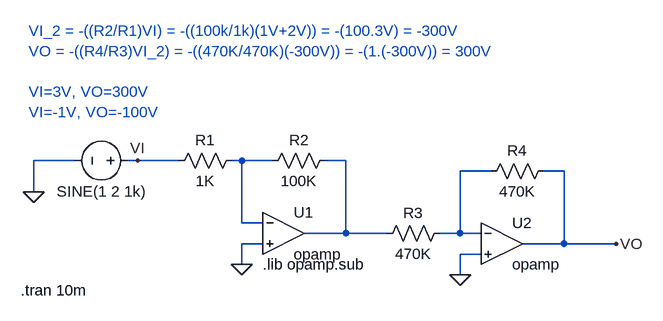
[diagram p0: schematic AMP18 - Amplificadores em Cascata.asc]
AMP18 - Amplificadores em Cascata.asc, the LTspice schematic file:
Version 4
SHEET 1 880 680
WIRE -336 32 -400 32
WIRE -240 32 -256 32
WIRE -176 32 -240 32
WIRE -80 32 -96 32
WIRE -32 32 -80 32
WIRE 80 32 48 32
WIRE 304 48 256 48
WIRE 416 48 384 48
WIRE -400 80 -400 32
WIRE -80 128 -80 32
WIRE -48 128 -80 128
WIRE 80 144 80 32
WIRE 80 144 16 144
WIRE 144 144 80 144
WIRE 256 144 256 48
WIRE 256 144 224 144
WIRE 288 144 256 144
WIRE -48 160 -80 160
WIRE 416 160 416 48
WIRE 416 160 352 160
WIRE 496 160 416 160
WIRE 288 176 256 176
WIRE -80 192 -80 160
WIRE 256 208 256 176
FLAG -240 32 VI
FLAG 496 160 VO
FLAG -80 192 0
FLAG 256 208 0
FLAG -400 80 0
SYMBOL Opamps\\opamp -16 80 R0
SYMATTR InstName U1
SYMBOL Opamps\\opamp 320 96 R0
SYMATTR InstName U2
SYMBOL res 240 128 R90
WINDOW 0 0 56 VBottom 2
WINDOW 3 32 56 VTop 2
SYMATTR InstName R3
SYMATTR Value 470K
SYMBOL res 400 32 R90
WINDOW 0 0 56 VBottom 2
WINDOW 3 32 56 VTop 2
SYMATTR InstName R4
SYMATTR Value 470K
SYMBOL res 64 16 R90
WINDOW 0 0 56 VBottom 2
WINDOW 3 32 56 VTop 2
SYMATTR InstName R2
SYMATTR Value 100K
SYMBOL res -80 16 R90
WINDOW 0 0 56 VBottom 2
WINDOW 3 32 56 VTop 2
SYMATTR InstName R1
SYMATTR Value 1K
SYMBOL voltage -240 32 R90
WINDOW 0 -32 56 Invisible 2
WINDOW 3 32 56 VTop 2
WINDOW 123 0 0 Left 2
WINDOW 39 0 0 Left 2
SYMATTR InstName V1
SYMATTR Value SINE(1 2 1k)
TEXT -48 192 Left 2 !.lib opamp.sub
TEXT -408 -168 Left 2 ;VI_2 = -((R2/R1)VI) = -((100k/1k)(1V+2V)) = -(100.3V) = -300V\nVO = -((R4/R3)VI_2) = -((470K/470K)(-300V)) = -(1.(-300V)) = 300V \n \nVI=3V, VO=300V\nVI=-1V, VO=-100V
TEXT -420 232 Left 2 !.tran 10m

The netlist it stands for:
* AMP18 - Amplificadores em Cascata.asc
XU1 N001 0 N002 opamp Aol=100K GBW=10Meg  ; pins invin noninvin out
XU2 N003 0 VO opamp Aol=100K GBW=10Meg  ; pins invin noninvin out
R3 N003 N002 470K
R4 VO N003 470K
R2 N002 N001 100K
R1 N001 VI 1K
V1 VI 0 SINE(1 2 1k)
.lib opamp.sub
* VI_2 = -((R2/R1)VI) = -((100k/1k)(1V+2V)) = -(100.3V) = -300V
* VO = -((R4/R3)VI_2) = -((470K/470K)(-300V)) = -(1.(-300V)) = 300V
* VI=3V, VO=300V
* VI=-1V, VO=-100V
.tran 10m
.backanno
.end